# Altium project Trolly Discharge R1.PrjPcb
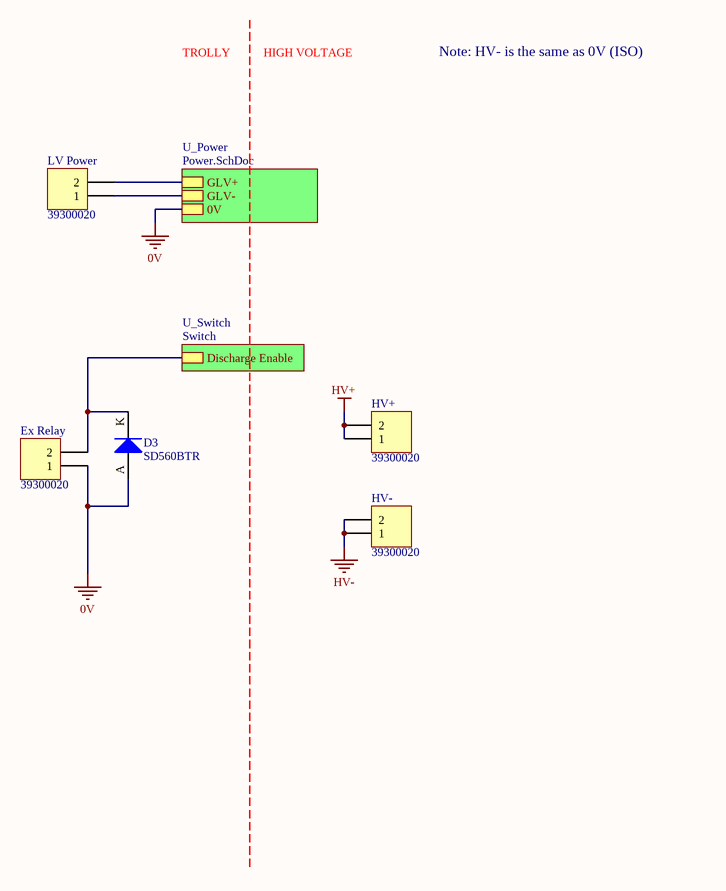
[diagram p0: Top Level.SchDoc]
3 sheets, 42 parts. Net scope: hierarchical (ports join the sheet entries above them; power ports are global).
Board file: PCB.PcbDoc
Sheets:
  Top Level.SchDoc
    U_Switch = Switch.SchDoc
    U_Power = Power.SchDoc

## Sheet Top Level.SchDoc
size A

### Parts
D3  SD560BTR  [SMB Diode]
Ex_Relay  39300020  [39300020]
HV+  39300020  [39300020]
HV-  39300020  [39300020]
LV_Power  39300020  [39300020]

### Sub-sheets
U_Power = Power.SchDoc: GLV+, GLV-, 0V
U_Switch = Switch: Discharge Enable

### Nets
0V: D3.A Ex_Relay.1 LV_Power.1 ; sheet U_Power/GLV-, sheet U_Power/0V
HV+: HV+.1 HV+.2
HV-: HV-.1 HV-.2
NetD3_K: D3.K Ex_Relay.2 ; sheet U_Switch/Discharge Enable
NetF1_1: LV_Power.2 ; sheet U_Power/GLV+

### Notes on the sheet
- TROLLY
- HIGH VOLTAGE
- Note: HV- is the same as 0V (ISO)

### Library data of the parts
D3 = SD560BTR: 1.2V_F 600V 5A SMB; Manufacturer: SMC Diode Solutions; Part Number: SD560BTR; Digikey Part Number: 1655-1530-2-ND; Digikey Link: https://www.digikey.com/product-detail/en/smc-diode-solutions/SD560BTR/1655-1530-2-ND/6022620
Ex_Relay HV+ HV- LV_Power = 39300020: Pitch: 4.2mm; Row Spacing: 5.5mm; Angle: 90; Flange: No; Contact: Tin; Part Number: 39300020; Positions: 2; Digikey Part Number: WM21351-ND

## Sheet Switch.SchDoc
size A
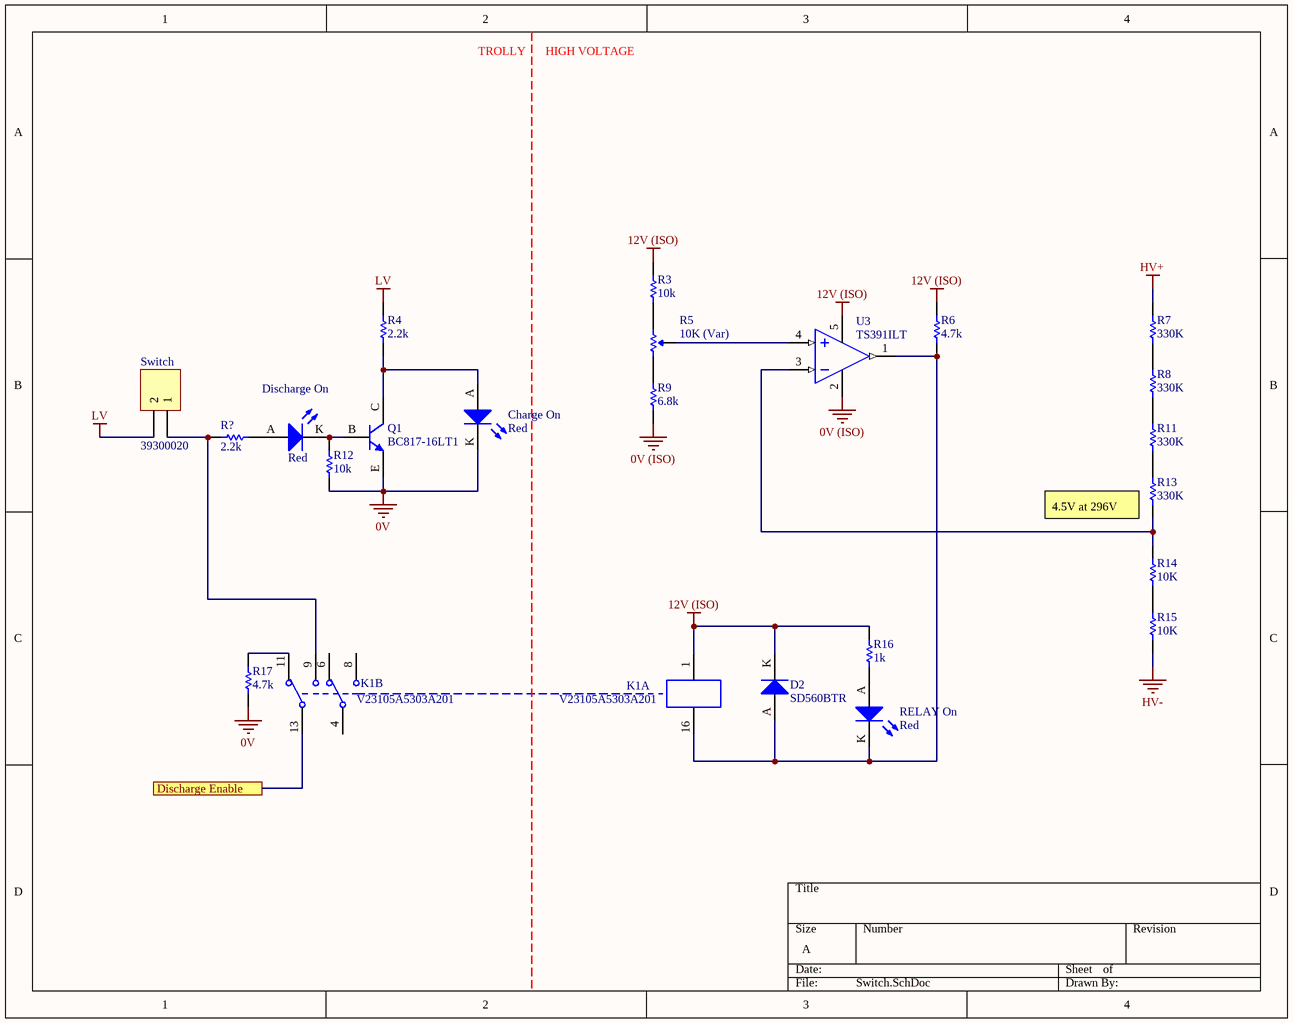
[diagram p1: Switch.SchDoc]

### Parts
Charge_On  Red  [0805 LED]
D2  SD560BTR  [SMB Diode]
Discharge_On  Red  [0805 LED]
K1  V23105A5303A201  [TI 2-DIL]  (parts A,B of 2)
Q1  BC817-16LT1  [ON SOT-23 BJT]
R3  10k  [0805]
R4  2.2k  [0805]
R5  10K (Var)  [B 3296]
R6  4.7k  [0805]
R7  330K  [VB 0204]
R8  330K  [VB 0204]
R9  6.8k  [0805]
R11  330K  [VB 0204]
R12  10k  [0805]
R13  330K  [VB 0204]
R14  10K  [VB 0204]
R15  10K  [VB 0204]
R16  1k  [0805]
R17  4.7k  [0805]
R?  2.2k  [0805]
RELAY_On  Red  [0805 LED]
Switch  39300020  [39300020]
U3  TS391ILT  [ON SOT-23-5]

### Ports
Discharge Enable

### Nets
0V: Charge_On.K Q1.E R12.1 R17.2
0V (ISO): R9.1 U3.2(VCC-)
12V (ISO): D2.K K1.1 R3.2 R6.2 R16.2 U3.5(VCC+)
HV+: R7.2
HV-: R15.1
LV: R4.2 Switch.2
NetCharge_On_A: Charge_On.A Q1.C R4.1
NetD2_A: D2.A K1.16 R6.1 RELAY_On.K U3.1(OUT)
NetD3_K: K1.13 ; port Discharge Enable
NetDischarge_On_A: Discharge_On.A R?.1
NetDischarge_On_K: Discharge_On.K Q1.B R12.2
NetK1_9: K1.9 R?.2 Switch.1
NetK1_11: K1.11 R17.1
NetR3_1: R3.1 R5.1(CCW)
NetR5_2: R5.2(Wiper) U3.4(IIN+)
NetR5_3: R5.3(CW) R9.2
NetR7_1: R7.1 R8.2
NetR8_1: R8.1 R11.2
NetR11_1: R11.1 R13.2
NetR13_1: R13.1 R14.2 U3.3(IN-)
NetR14_1: R14.1 R15.2
NetR16_1: R16.1 RELAY_On.A

Not connected (* = marked no-connect by the designer): K1 4 6 8

### Notes on the sheet
- TROLLY
- HIGH VOLTAGE
- (near R13) 4.5V at 296V

### Library data of the parts
Charge_On Discharge_On RELAY_On = SML-210LTT86: Red LED Indication - Discrete 1.75V 0805 (2012 Metric); Manufacturer: ROHM Semiconductor; Part Number: SML-210LTT86; Colour: Red; Digikey Part Number: 511-1286-1-ND; Digikey Link: https://www.digikey.com/product-detail/en/rohm-semiconductor/SML-210LTT86/511-1286-1-ND/637099
D2 = SD560BTR: as D3 on sheet Top Level; Part Number: SD560BTR; Digikey Part Number: 1655-1530-2-ND; Digikey Link: https://www.digikey.com/product-detail/en/smc-diode-solutions/SD560BTR/1655-1530-2-ND/6022620
K1 = V23105A5303A201: RELAY TELECOM DPDT 3A 12V; Manufacturer: TE Connectivity; Part Number: V23105A5303A201; Digikey Part Number: PB387-ND; Digikey Link: https://www.digikey.com/product-detail/en/te-connectivity-potter-brumfield-relays/V23105A5303A201/PB387-ND/291023
Q1 = BC817-16LT1: 300mW  BJT NPN Transistor; Manufacturer: ON Semiconductor; Part Number: BC817-16LT1; Digikey Part Number: BC817-16LT1OSTR-ND; Digikey Link: https://www.digikey.com.au/product-detail/en/on-semiconductor/BC817-16LT1/BC817-16LT1OSTR-ND/606178
R3 R12 = RC0805FR0710KL: Manufacturer: YAGEO; Tolerance: 0.01; Rated Voltage: 0.125W; Part Number: RC0805FR0710KL; Value: 10k; Material: FR-07; Digikey Part Number: 311-10.0KCRCT-ND
R4 R? = RC0805FR072K2L: Manufacturer: YAGEO; Tolerance: 0.01; Rated Voltage: 0.125W; Part Number: RC0805FR072K2L; Value: 2.2k; Material: FR-07; Digikey Part Number: 311-2.20KCRCT-ND
R5 = 3296W-1-103LF: Manufacturer: Bournes Inc; Tolerance: 0.1; Rated Voltage: 0.5W; Part Number: 3296W-1-103LF; Value: 10K (Var); Digikey Part Number: 3296W-103LF-ND
R6 R17 = RC0805FR074K7L: Manufacturer: YAGEO; Tolerance: 0.01; Rated Voltage: 0.125W; Part Number: RC0805FR074K7L; Value: 4.7k; Material: FR-07; Digikey Part Number: 311-4.70KCRCT-ND
R7 R8 R11 R13 = MMA02040C3303FB300: Manufacturer: Vishay Beyschlag; Tolerance: 0.01; Rated Voltage: 0.4W; Part Number: MMA02040C3303FB300; Value: 330K; Digikey Part Number: MMA-330KACT-ND
R9 = RC0805FR076K8L: Manufacturer: YAGEO; Tolerance: 0.01; Rated Voltage: 0.125W; Part Number: RC0805FR076K8L; Value: 6.8k; Material: FR-07; Digikey Part Number: 311-6.80KCRCT-ND
R14 R15 = MMA02040C1002FB300: Manufacturer: Vishay Beyschlag; Tolerance: 0.01; Rated Voltage: 0.4W; Part Number: MMA02040C1002FB300; Value: 10K; Digikey Part Number: MMA-10KACT-ND
R16 = RC0805FR071KL: Manufacturer: YAGEO; Tolerance: 0.01; Rated Voltage: 0.125W; Part Number: RC0805FR071KL; Value: 1k; Material: FR-07; Digikey Part Number: 311-1.00KCRCT-ND
Switch = 39300020: as Ex_Relay on sheet Top Level; Part Number: 39300020; Positions: 2; Digikey Part Number: WM21351-ND
U3 = TS391ILT: IC COMP LO PWR SGL V SOT 23-5L; Manufacturer: STMicroelectronics; Part Number: TS391ILT; Digikey Part Number: 497-2275-2-ND; Digikey Link: https://www.digikey.com/product-detail/en/stmicroelectronics/TS391ILT/497-2275-2-ND/599407

## Sheet Power.SchDoc
size A
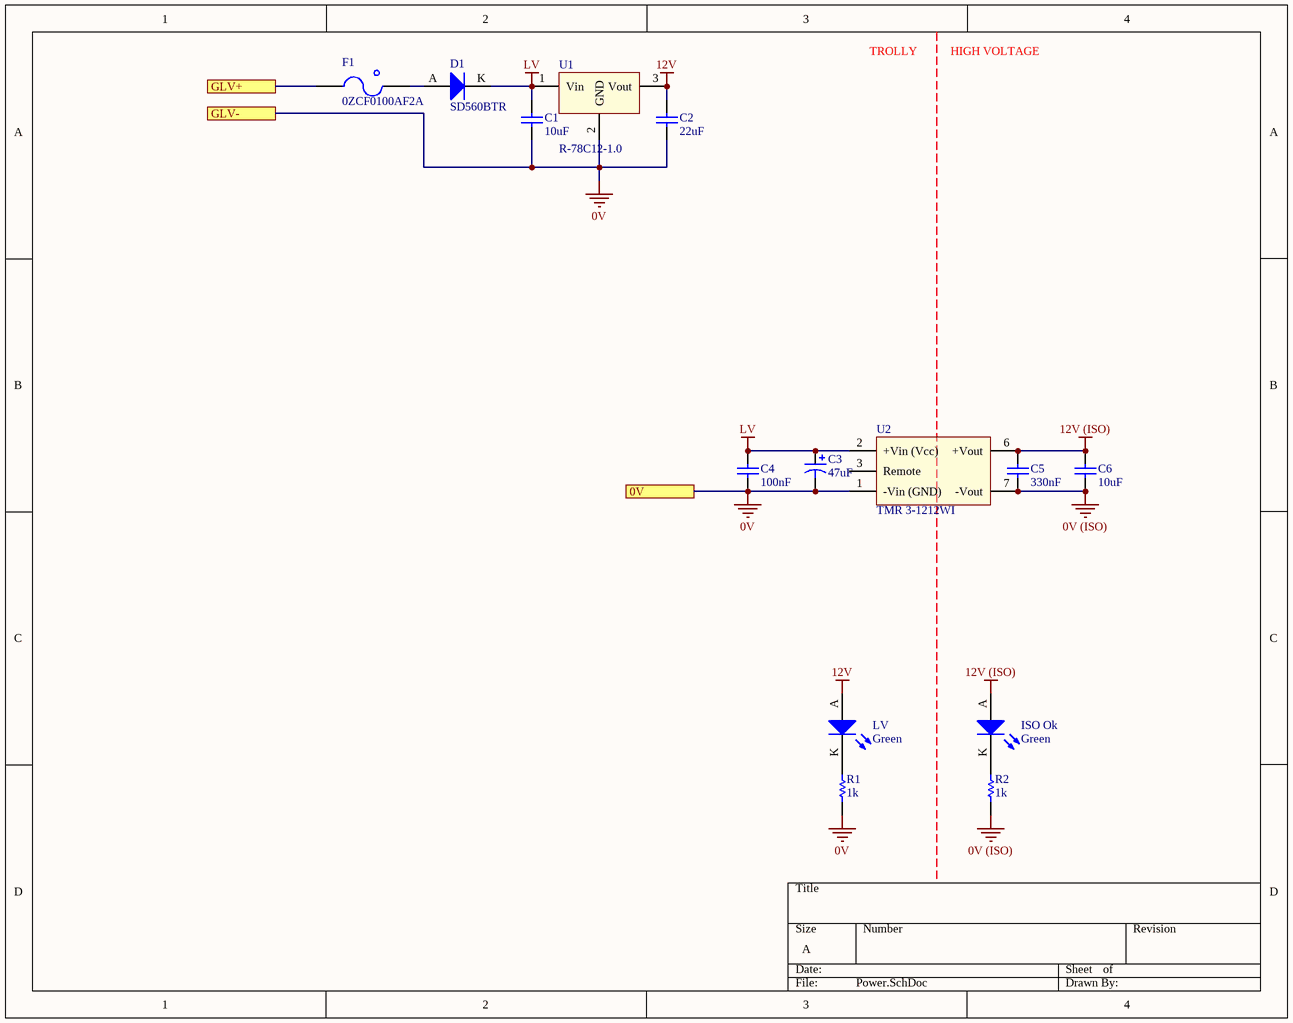
[diagram p2: Power.SchDoc]

### Parts
C1  10uF  [0805]
C2  22uF  [1206]
C3  47uF  [2924]
C4  100nF  [0805]
C5  330nF  [0805]
C6  10uF  [0805]
D1  SD560BTR  [SMB Diode]
F1  0ZCF0100AF2A  [2920]
ISO_Ok  Green  [0805 LED]
LV  Green  [0805 LED]
R1  1k  [0805]
R2  1k  [0805]
U1  R-78C12-1.0  [RECOM 3-SIP]
U2  TMR 3-1212WI  [TRECO 8-SIP]

### Ports
0V, GLV+, GLV-

### Nets
0V: C1.1 C2.1 C3.1 C4.1 R1.1 U1.2(GND) U2.1(-Vin_(GND)) ; port GLV-, port 0V
0V (ISO): C5.1 C6.1 R2.1 U2.7(-Vout)
12V: C2.2 LV.A U1.3(Vout)
12V (ISO): C5.2 C6.2 ISO_Ok.A U2.6(+Vout)
LV: C1.2 C3.2 C4.2 D1.K U1.1(Vin) U2.2(+Vin_(Vcc))
NetD1_A: D1.A F1.2
NetF1_1: F1.1 ; port GLV+
NetISO_Ok_K: ISO_Ok.K R2.2
NetLV_K: LV.K R1.2

Not connected (* = marked no-connect by the designer): U2 3(Remote)

### Notes on the sheet
- TROLLY
- HIGH VOLTAGE

### Library data of the parts
C1 C6 = GRM21BR6YA106KE43L: Manufacturer: muRata; Tolerance: 10%; Material: X5R; Rated Voltage: 50V; Part Number: GRM21BR6YA106KE43L; Value: 10uF; Digikey Part Number: 490-10514-6-ND
C2 = CC1206MKX5R7BB226: Manufacturer: YAGEO; Tolerance: 20%; Material: Ceramic; Rated Voltage: 16V; Part Number: CC1206MKX5R7BB226; Value: 22uF; Digikey Part Number: 311-1997-2-ND
C3 = TAJV476K035RNJ: Manufacturer: AVX Corporation; Tolerance: 10%; Material: Tantalum; Rated Voltage: 35V; Part Number: TAJV476K035RNJ; Value: 47uF; Digikey Part Number: 478-8934-1-ND
C4 = GCM21BR71H104KA37L: Manufacturer: muRata; Tolerance: ±10%; Material: X7R; Rated Voltage: 50V; Part Number: GCM21BR71H104KA37L; Value: 100nF; Digikey Part Number: 490-6064-1-ND
C5 = GCM219R71H334KA55D: Manufacturer: muRata; Tolerance: ±10%; Material: X7R; Rated Voltage: 50V; Part Number: GCM219R71H334KA55D; Value: 330nF; Digikey Part Number: 490-8045-1-ND
D1 = SD560BTR: as D3 on sheet Top Level; Part Number: SD560BTR; Digikey Part Number: 1655-1530-2-ND; Digikey Link: https://www.digikey.com/product-detail/en/smc-diode-solutions/SD560BTR/1655-1530-2-ND/6022620
F1 = 0ZCF0100AF2A: PTC RESET FUSE 60V 1A 292; Manufacturer: Littelfuse Inc.; Part Number: 0ZCF0100AF2A; Digikey Part Number: 507-2070-1-ND; Digikey Link: https://www.digikey.com/product-detail/en/bel-fuse-inc/0ZCF0100AF2A/507-2070-1-ND/6210547
ISO_Ok LV = SML-210FTT86: Green LED Indication - Discrete 1.75V 0805 (2012 Metric); Manufacturer: ROHM Semiconductor; Part Number: SML-210FTT86; Colour: Green; Digikey Part Number: 511-1285-1-ND; Digikey Link: https://www.digikey.com/product-detail/en/rohm-semiconductor/SML-210FTT86/511-1285-1-ND/637098
R1 R2 = RC0805FR071KL: as R16 on sheet Switch; Part Number: RC0805FR071KL; Value: 1k; Material: FR-07; Digikey Part Number: 311-1.00KCRCT-ND
U1 = R-78C12-1.0: 3PIN DC DC CONVERTER 12V 12W; Manufacturer: Recom; Isolation: Non-Isolated; Part Number: R-78C12-1.0; Digikey Part Number: 945-1392-5-ND; Digikey Link: https://www.digikey.com/products/en/power-supplies-board-mount/dc-dc-converters/922?k=R-78C&k=&pkeyword=R-78C&sv=0&pv1525=44&sf=0&FV=ffe0039a&quantity=&ColumnSort=0&page=1&pageSize=25
U2 = TMR 3-1212WI: DC DC CONVERTER 12V 3W; Manufacturer: Traco Power; Isolation: Isolated; Part Number: TMR 3-1212WI; Digikey Part Number: 1951-2367-ND; Digikey Link: https://www.digikey.com.au/product-detail/en/traco-power/TMR-3-1212WI/1951-2367-ND/9383402

## Nets that join several sheets
0V: Top Level (D3.A Ex_Relay.1 LV_Power.1), Switch (Charge_On.K Q1.E R12.1 R17.2), Power (7 pins)
0V (ISO): Switch (R9.1 U3.2), Power (C5.1 C6.1 R2.1 U2.7)
12V (ISO): Switch (6 pins), Power (C5.2 C6.2 ISO_Ok.A U2.6)
HV+: Top Level (HV+.1 HV+.2), Switch (R7.2)
HV-: Top Level (HV-.1 HV-.2), Switch (R15.1)
LV: Switch (R4.2 Switch.2), Power (6 pins)
NetD3_K: Top Level (D3.K Ex_Relay.2), Switch (K1.13)
NetF1_1: Top Level (LV_Power.2), Power (F1.1)